# EAGLE schematic USB (EAGLE 7.4.0)
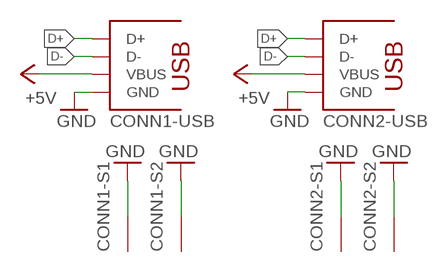
[diagram p0: schematic, sheet 1]

## Parts
CONN1  USB-B-V  [USB-B-PTH-V]
CONN2  USB-A-H  [USB-A-PTH]

## Nets
+5V: CONN1.VBUS(-USB:VBUS) CONN2.VBUS(-USB:VBUS)
D+: CONN1.D+(-USB:D+) CONN2.D+(-USB:D+)
D-: CONN1.D-(-USB:D-) CONN2.D-(-USB:D-)
GND: CONN1.GND(-USB:GND) CONN1.S1(-S1:S) CONN1.S2(-S2:S) CONN2.GND(-USB:GND) CONN2.S1(-S1:S) CONN2.S2(-S2:S)

## Library data of the parts
CONN1 = igor_lbr:USB: USB B connector, horizontal; MANUFACTURER: CUI Devices; MPN: UJ2-BV-1-TH
CONN2 = igor_lbr:USB: USB B connector, horizontal